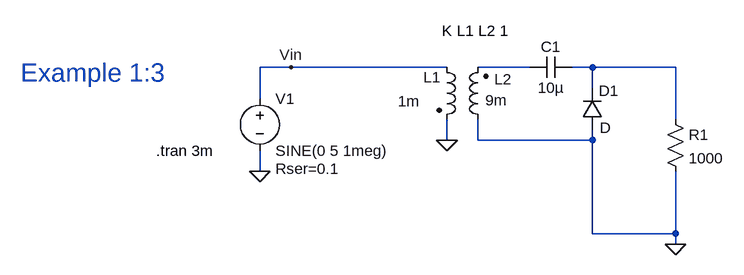
[diagram p0: schematic Voltage-doubler-villard.asc]
Voltage-doubler-villard.asc, the LTspice schematic file:
Version 4.1
SHEET 1 880 756
WIRE -48 32 -96 32
WIRE 192 32 -48 32
WIRE 320 32 240 32
WIRE 416 32 384 32
WIRE 544 32 416 32
WIRE 416 64 416 32
WIRE -96 80 -96 32
WIRE 544 112 544 32
WIRE 192 144 192 112
WIRE 240 144 240 112
WIRE 416 144 416 128
WIRE 416 144 240 144
WIRE -96 192 -96 160
WIRE 416 288 416 144
WIRE 544 288 544 192
WIRE 544 288 416 288
WIRE 544 304 544 288
FLAG -96 192 0
FLAG 192 144 0
FLAG 544 304 0
FLAG -48 32 Vin
SYMBOL voltage -96 64 R0
WINDOW 123 0 0 Left 0
WINDOW 39 24 124 Left 2
SYMATTR SpiceLine Rser=0.1
SYMATTR InstName V1
SYMATTR Value SINE(0 5 1meg)
SYMBOL ind2 176 16 R0
WINDOW 0 -20 31 Left 2
WINDOW 3 -59 68 Left 2
SYMATTR InstName L1
SYMATTR Value 1m
SYMBOL ind2 256 128 R180
WINDOW 0 -36 78 Left 2
WINDOW 3 -29 45 Left 2
SYMATTR InstName L2
SYMATTR Value 9m
SYMBOL res 528 96 R0
SYMATTR InstName R1
SYMATTR Value 1000
SYMBOL cap 384 16 R90
WINDOW 0 0 32 VBottom 2
WINDOW 3 32 32 VTop 2
SYMATTR InstName C1
SYMATTR Value 10µ
SYMBOL diode 432 128 R180
WINDOW 0 -25 60 Left 2
WINDOW 3 -13 3 Left 2
SYMATTR InstName D1
TEXT -256 160 Left 2 !.tran 3m
TEXT 184 -24 Left 2 !K L1 L2 1
TEXT -464 40 Left 4 ;Example 1:3

The netlist it stands for:
* Voltage-doubler-villard.asc
V1 Vin 0 SINE(0 5 1meg) Rser=0.1
L1 Vin 0 1m
L2 0 N001 9m
R1 N002 0 1000
C1 N002 N001 10µ
D1 0 N002 D
.model D D
.lib standard.dio
.tran 3m
K L1 L2 1
* Example 1:3
.backanno
.end